# Altium project cat.PrjPcb (part 4 of 6)

## Sheet power.SchDoc: Power
size A3; SheetNumber: 4; SheetTotal: 6
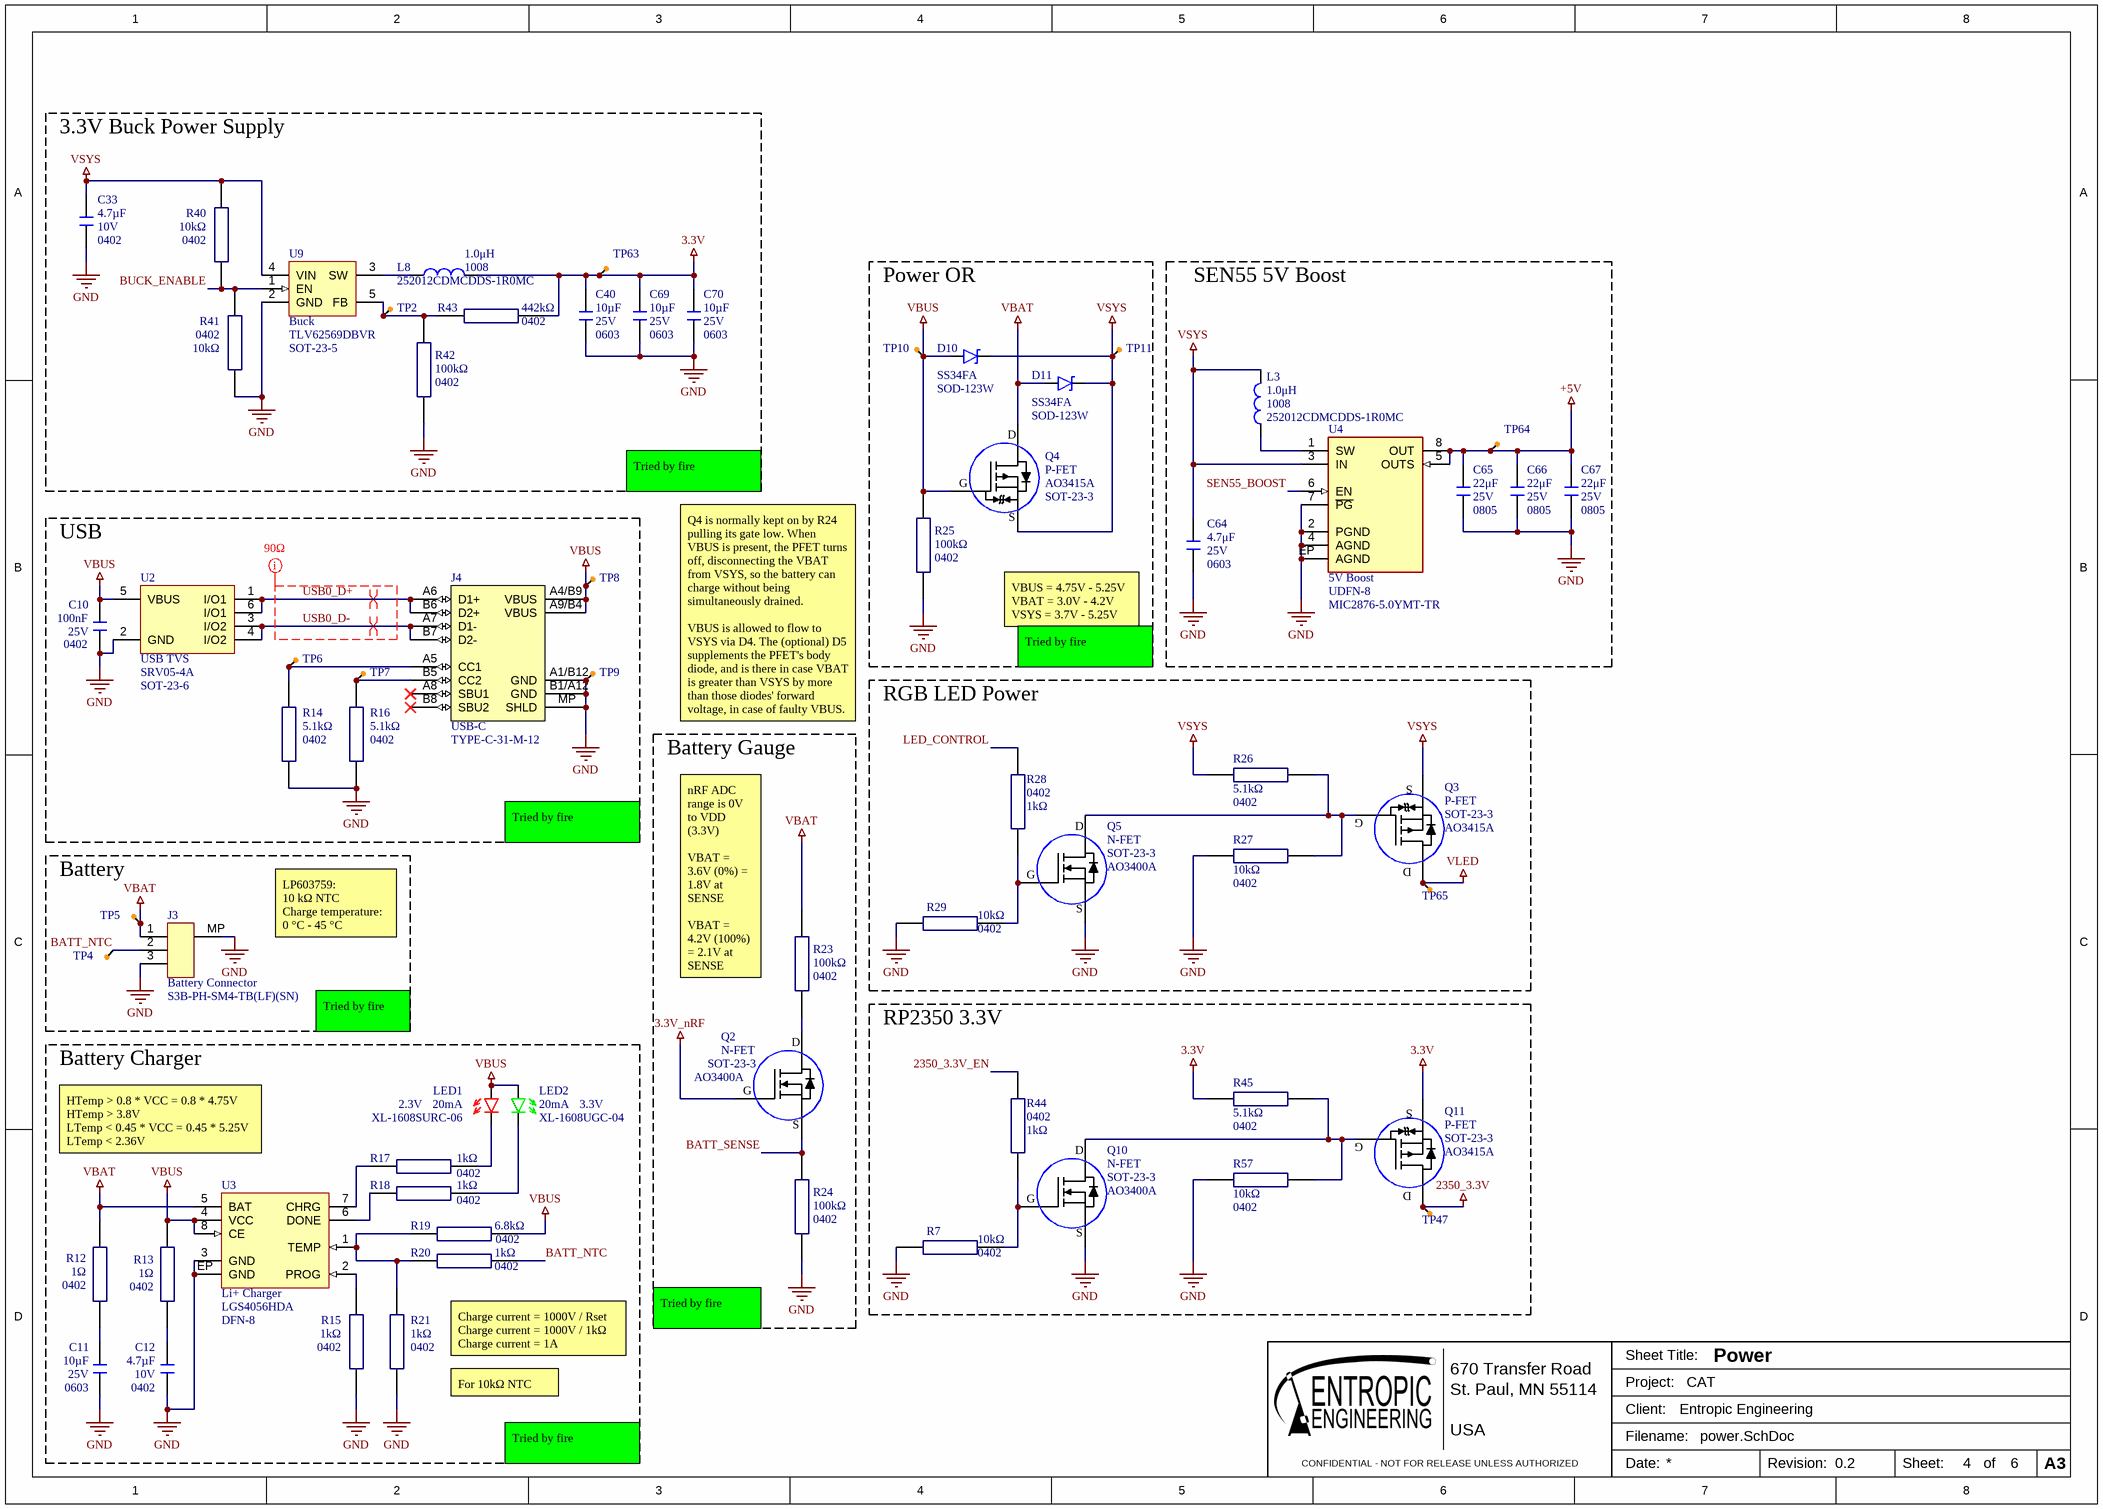
[diagram p3: power.SchDoc]

### Parts
C10  Case Code (Imperial): 0402  Voltage: 25V  Capacitance: 100nF  [0402_capacitor]  (hidden comment: GRM155R71E104KE14D)
C11  value 10µF  Case/Package: 0603  Voltage Rating: 25V  [0603_capacitor]  (hidden comment: CL10A106MA8NRNC)
C12  value 4.7µF  Voltage Rating: 10V  Case/Package: 0402  [0402_capacitor]  (hidden comment: CL05A475KP5NRNC)
C33  value 4.7µF  Voltage Rating: 10V  Case/Package: 0402  [0402_capacitor]  (hidden comment: CL05A475KP5NRNC)
C40  value 10µF  Case/Package: 0603  Voltage Rating: 25V  [0603_capacitor]  (hidden comment: CL10A106MA8NRNC)
C64  value 4.7μF  Case/Package: 0603  Voltage Rating: 25V  [0603_capacitor]  (hidden comment: C1608X5R1E475K080AC)
C65  value 22μF  Rated DC Voltage (URdc): 25V  Case/Package: 0805  [0805_capacitor]  (hidden comment: GRT21BR61E226ME13L)
C66  value 22μF  Rated DC Voltage (URdc): 25V  Case/Package: 0805  [0805_capacitor]  (hidden comment: GRT21BR61E226ME13L)
C67  value 22μF  Rated DC Voltage (URdc): 25V  Case/Package: 0805  [0805_capacitor]  (hidden comment: GRT21BR61E226ME13L)
C69  value 10µF  Case/Package: 0603  Voltage Rating: 25V  [0603_capacitor]  (hidden comment: CL10A106MA8NRNC)
C70  value 10µF  Case/Package: 0603  Voltage Rating: 25V  [0603_capacitor]  (hidden comment: CL10A106MA8NRNC)
D10  Case/Package: SOD-123W  [SOD-123]  (hidden comment: SS34FA)
D11  Case/Package: SOD-123W  [SOD-123]  (hidden comment: SS34FA)
J3  Battery Connector  [S3B-PH-SM4-TB]
J4  USB-C  Manufacturer Part Number: TYPE-C-31-M-12  [USB_C_2.0_M12]
L3  value 1.0μH  Package: 1008  [INDC2520X12N]  (hidden comment: 252012CDMCDDS-1R0MC)
L8  value 1.0μH  Package: 1008  [INDC2520X12N]  (hidden comment: 252012CDMCDDS-1R0MC)
LED1  Current: 20mA  Forward Voltage: 2.3V  [0603_DIODE]  (hidden comment: XL-1608SURC-06)
LED2  Current: 20mA  Forward Voltage: 3.3V  [0603_DIODE]  (hidden comment: XL-1608UGC-04)
Q2  N-FET  Case/Package: SOT-23-3  [SOT95P280X115-3N]
Q3  P-FET  Case/Package: SOT-23-3  [SOT95P280X115-3N]
Q4  P-FET  Case/Package: SOT-23-3  [SOT95P280X115-3N]
Q5  N-FET  Case/Package: SOT-23-3  [SOT95P280X115-3N]
Q10  N-FET  Case/Package: SOT-23-3  [SOT95P280X115-3N]
Q11  P-FET  Case/Package: SOT-23-3  [SOT95P280X115-3N]
R7  value 10kΩ  Case Code (Imperial): 0402  [0402_resistor]  (hidden comment: RC0402FR-0710KL)
R12  value 1Ω  Case/Package: 0402  [0402_resistor]  (hidden comment: 0402WGF100KTCE)
R13  value 1Ω  Case/Package: 0402  [0402_resistor]  (hidden comment: 0402WGF100KTCE)
R14  value 5.1kΩ  Case/Package: 0402  [0402_resistor]  (hidden comment: RC0402FR-075K1L)
R15  value 1kΩ  Case/Package: 0402  [0402_resistor]  (hidden comment: Rset)
R16  value 5.1kΩ  Case/Package: 0402  [0402_resistor]  (hidden comment: RC0402FR-075K1L)
R17  value 1kΩ  Case/Package: 0402  [0402_resistor]  (hidden comment: RC0402JR-071KL)
R18  value 1kΩ  Case/Package: 0402  [0402_resistor]  (hidden comment: RC0402JR-071KL)
R19  value 6.8kΩ  Case/Package: 0402  [0402_resistor]  (hidden comment: RC0402FR-076K8L)
R20  value 1kΩ  Case/Package: 0402  [0402_resistor]  (hidden comment: RC0402JR-071KL)
R21  value 1kΩ  Case/Package: 0402  [0402_resistor]  (hidden comment: Rset)
R23  value 100kΩ  Case/Package: 0402  [0402_resistor]  (hidden comment: RC0402FR-07100KL)
R24  value 100kΩ  Case/Package: 0402  [0402_resistor]  (hidden comment: RC0402FR-07100KL)
R25  value 100kΩ  Case/Package: 0402  [0402_resistor]  (hidden comment: RC0402FR-07100KL)
R26  value 5.1kΩ  Case/Package: 0402  [0402_resistor]  (hidden comment: RC0402FR-075K1L)
R27  value 10kΩ  Case Code (Imperial): 0402  [0402_resistor]  (hidden comment: RC0402FR-0710KL)
R28  value 1kΩ  Case/Package: 0402  [0402_resistor]  (hidden comment: RC0402JR-071KL)
R29  value 10kΩ  Case Code (Imperial): 0402  [0402_resistor]  (hidden comment: RC0402FR-0710KL)
R40  value 10kΩ  Case Code (Imperial): 0402  [0402_resistor]  (hidden comment: RC0402FR-0710KL)
R41  value 10kΩ  Case Code (Imperial): 0402  [0402_resistor]  (hidden comment: RC0402FR-0710KL)
R42  value 100kΩ  Case/Package: 0402  [0402_resistor]  (hidden comment: RC0402FR-07100KL)
R43  value 442kΩ  Case/Package: 0402  [0402_resistor]  (hidden comment: RC0402FR-07442KL)
R44  value 1kΩ  Case/Package: 0402  [0402_resistor]  (hidden comment: RC0402JR-071KL)
R45  value 5.1kΩ  Case/Package: 0402  [0402_resistor]  (hidden comment: RC0402FR-075K1L)
R57  value 10kΩ  Case Code (Imperial): 0402  [0402_resistor]  (hidden comment: RC0402FR-0710KL)
TP2  test_point-1  [test_point-1]  (value not drawn)  (no BOM)
TP4  test_point-1  [test_point-1]  (value not drawn)  (no BOM)
TP5  VBAT  [test_point-1]  (value not drawn)  (no BOM)
TP6  test_point-1  [test_point-1]  (value not drawn)  (no BOM)
TP7  test_point-1  [test_point-1]  (value not drawn)  (no BOM)
TP8  VBUS  [test_point-1]  (value not drawn)  (no BOM)
TP9  GND  [test_point-1]  (value not drawn)  (no BOM)
TP10  VBUS  [test_point-1]  (value not drawn)  (no BOM)
TP11  VSYS  [test_point-1]  (value not drawn)  (no BOM)
TP47  VLED  [test_point-1]  (value not drawn)  (no BOM)
TP63  Main 3.3V  [test_point-1]  (value not drawn)  (no BOM)
TP64  Sensors 5V  [test_point-1]  (value not drawn)  (no BOM)
TP65  VLED  [test_point-1]  (value not drawn)  (no BOM)
U2  USB TVS  Case/Package: SOT-23-6  [SOT95P280X110-6N]
U3  Li+ Charger  Manufacturer Part Number: LGS4056HDA  Package: DFN-8  [SON50P200X80_HS-9N]
U4  5V Boost  Case/Package: UDFN-8  [SON50P200X50_HS-9N]
U9  Buck  Case/Package: SOT-23-5  [SOT95P280X115-5N]

### Blocks framed on the sheet
3.3V Buck Power Supply: C33 C40 C69 C70 L8 R40-R43 TP2 TP63 U9
Power OR: D10 D11 Q4 R25 TP10 TP11
SEN55 5V Boost: C64-C67 L3 TP64 U4
USB: C10 J4 R14 R16 TP6-TP9 U2
RGB LED Power: Q3 Q5 R26-R29 TP65
Battery Gauge: Q2 R23 R24
Battery: J3 TP4 TP5
RP2350 3.3V: Q10 Q11 R7 R44 R45 R57 TP47
Battery Charger: C11 C12 LED1 LED2 R12 R13 R15 R17-R21 U3

### Nets
3.3V: C40.2 C69.2 C70.2 L8.2 Q11.2(S) R43.2 R45.2 TP63.1
3.3V_nRF: Q2.1(G)
2350_3.3V: Q11.3(D) TP47.1
+5V: C65.2 C66.2 C67.2 TP64.1 U4.5(OUTS) U4.8(OUT)
GND: C10.1 C11.1 C12.1 C33.1 C40.1 C64.1 C65.1 C66.1 C67.1 C69.1 C70.1 J3.3 J3.MP J4.A1/B12(GND) J4.B1/A12(GND) J4.MP(SHLD) Q5.2(S) Q10.2(S) R7.2 R14.1 R15.1 R16.1 R21.1 R24.1 R25.1 R27.2 R29.2 R41.1 R42.1 R57.2 TP9.1 U2.2(GND) U3.3(GND) U3.EP(GND) U4.2(PGND) U4.4(AGND) U4.7(~{PG}) U4.EP(AGND) U9.2(GND)
VBAT: D11.A J3.1 Q4.3(D) R12.2 R23.2 TP5.1 U3.5(BAT)
VBUS: C10.2 D10.A J4.A4/B9(VBUS) J4.A9/B4(VBUS) LED1.2 LED2.2 Q4.1(G) R13.2 R19.1 R25.2 TP8.1 TP10.1 U2.5(VBUS) U3.4(VCC) U3.8(CE)
VLED: Q3.3(D) TP65.1
VSYS: C33.2 C64.2 D10.K D11.K L3.1 Q3.2(S) Q4.2(S) R26.2 R40.2 TP11.1 U4.3(IN) U9.4(VIN)
2350_3.3V_EN: R44.1
BATT_NTC: J3.2 R20.1 TP4.1
BATT_SENSE: Q2.2(S) R24.2
BUCK_ENABLE: R40.1 R41.2 U9.1(EN)
LED_CONTROL: R28.1
SEN55_BOOST: U4.6(EN)
USB0_D+: J4.A6(D1+) J4.B6(D2+) U2.1(I/O1) U2.6(I/O1)
USB0_D-: J4.A7(D1-) J4.B7(D2-) U2.3(I/O2) U2.4(I/O2)
NetC11_2: C11.2 R12.1
NetC12_2: C12.2 R13.1
NetJ4_A5: J4.A5(CC1) R14.2 TP6.1
NetJ4_B5: J4.B5(CC2) R16.2 TP7.1
NetL3_2: L3.2 U4.1(SW)
NetL8_1: L8.1 U9.3(SW)
NetLED1_1: LED1.1 R17.1
NetLED2_1: LED2.1 R18.1
NetQ2_3: Q2.3(D) R23.1
NetQ3_1: Q3.1(G) Q5.3(D) R26.1 R27.1
NetQ5_1: Q5.1(G) R28.2 R29.1
NetQ10_1: Q10.1(G) R7.1 R44.2
NetQ10_3: Q10.3(D) Q11.1(G) R45.1 R57.1
NetR15_2: R15.2 U3.2(PROG)
NetR17_2: R17.2 U3.7(CHRG)
NetR18_2: R18.2 U3.6(DONE)
NetR19_2: R19.2 R20.2 R21.2 U3.1(TEMP)
NetR42_2: R42.2 R43.1 TP2.1 U9.5(FB)

Not connected (* = marked no-connect by the designer): J4 A8(SBU1)* B8(SBU2)*

### Layout directives
net class 90_OHM: USB0_D+, USB0_D-
differential pair; differential pair class USB_DIFF: USB0_D+, USB0_D-

### Notes on the sheet
- Tried by fire
- VBUS = 4.75V - 5.25V
  VBAT = 3.0V - 4.2V
  VSYS = 3.7V - 5.25V
- Q4 is normally kept on by R24 pulling its gate low. When VBUS is present, the PFET turns off, disconnecting the VBAT from VSYS, so the battery can charge without being simultaneously drained.
  VBUS is allowed to flow to VSYS via D4. The (optional) D5 supplements the PFET's body diode, and is there in case VBAT is greater than VSYS by more than those diodes' forward voltage, in case of faulty VBUS.
- LP603759:
  10 kΩ NTC
  Charge temperature:
  0 °C - 45 °C
- (near R23) nRF ADC range is 0V to VDD (3.3V)
  VBAT = 3.6V (0%) = 1.8V at SENSE
  VBAT = 4.2V (100%) = 2.1V at SENSE
- HTemp > 0.8 * VCC = 0.8 * 4.75V
  HTemp > 3.8V
  LTemp < 0.45 * VCC = 0.45 * 5.25V
  LTemp < 2.36V
- For 10kΩ NTC
- Charge current = 1000V / Rset
  Charge current = 1000V / 1kΩ
  Charge current = 1A
- 670 Transfer Road
- St. Paul, MN 55114
- Sheet Title:
- Project:
- CONFIDENTIAL - NOT FOR RELEASE UNLESS AUTHORIZED
- USA
- Client:
- Filename:
- Date:
- Revision:
- Sheet:
- of
- A3

### Library data of the parts
C10 = GRM155R71E104KE14D: 100 nF, 25 V, X7R, 0402 Chip capacitor; Manufacturer: Murata; house_part_number: C-100nF-0402-002; Dielectric Material: Ceramic; Tolerance: 10%; Supplier 1: Digi-Key; Supplier Part Number 1: 490-10698-1-ND; RoHS: Yes; Category: Ceramic Capacitors; Pricing 1: 1=0.10000, 10=0.02700, 50=0.01460, 100=0.01190, 500=0.00848, 1000=0.00666, 2500=0.00605, 5000=0.00557 (USD); Mount: Surface Mount; Case/Package: 0402; Case Code (Metric): 1005; Weight: 0.000212oz; Min Operating Temperature: -55°C; Max Operating Temperature: 125°C; Packaging: Tape and Reel; Voltage Rating: 25V; Dielectric: X7R; Termination: SMD/SMT; Resistor Type: Ceramic; Voltage Rating (DC): 25V; Package Quantity: 10000; Length: 1mm; Width: 0.02inch; Height: 0.5mm; Thickness: 0.022inch; Depth: 0.5mm; REACH SVHC: Unknown; Lead Free: Lead Free; RoHS Compliant: Yes; ComponentLink1URL: http://www.farnell.com/datasheets/1872206.pdf?src-supplier=Farnell; ComponentLink1Description: http://www.farnell.com/datasheets/1872206.pdf?src-supplier=Farnell; ComponentLink2URL: http://components.arrow.com/part/dataview/0323_06361249?src-supplier=Arrow+Europe; ComponentLink2Description: http://components.arrow.com/part/dataview/0323_06361249?src-supplier=Arrow+Europe; ComponentLink3URL: http://uk.rs-online.com/webdocs/144c/0900766b8144c113.pdf?src-supplier=RSComponents; ComponentLink3Description: http://uk.rs-online.com/webdocs/144c/0900766b8144c113.pdf?src-supplier=RSComponents; ComponentLink4URL: http://www.farnell.com/datasheets/2048008.pdf?src-supplier=Farnell; ComponentLink4Description: http://www.farnell.com/datasheets/2048008.pdf?src-supplier=Farnell; ComponentLink5URL: http://www.mouser.com/ds/2/281/c02e-2905.pdf?src-supplier=Mouser; ComponentLink5Description: http://www.mouser.com/ds/2/281/c02e-2905.pdf?src-supplier=Mouser; ComponentLink6URL: http://www.farnell.com/datasheets/2048008.pdf?src-supplier=Newark; ComponentLink6Description: http://www.farnell.com/datasheets/2048008.pdf?src-supplier=Newark; ComponentLink7URL: https://search.murata.co.jp/Ceramy/image/img/A01X/G101/ENG/GRM155R71E104KE14-01.pdf?src-supplier=Digi-Key; ComponentLink7Description: https://search.murata.co.jp/Ceramy/image/img/A01X/G101/ENG/GRM155R71E104KE14-01.pdf?src-supplier=Digi-Key; ComponentLink8URL: http://www.farnell.com/datasheets/2048008.pdf?src-supplier=Element14; ComponentLink8Description: http://www.farnell.com/datasheets/2048008.pdf?src-supplier=Element14; ComponentLink9URL: http://psearch.en.murata.com/capacitor/product/GRM155R71E104KE14%23.pdf?src-supplier=Avnet; ComponentLink9Description: http://psearch.en.murata.com/capacitor/product/GRM155R71E104KE14%23.pdf?src-supplier=Avnet; Manufacturer Part Number: GRM155R71E104KE14D
C11 C40 C69 C70 = CL10A106MA8NRNC: 10 µF, 25 V, X5R, 0603 Chip capacitor; Manufacturer: Samsung; house_part_number: C-10uF-0603-002; Tolerance: 20%; Material: 4241ConductorMaterial; RoHS: Yes; Category: Ceramic Capacitors; Case Code (Metric): 1608; Min Operating Temperature: -55°C; Max Operating Temperature: 85°C; Packaging: Cut Tape; RoHS Compliant: Yes; ComponentLink1URL: https://datasheet.ciiva.com/25766/cl10a106ma8nrnc-25766562.pdf?src-supplier=Digikey; ComponentLink1Description: https://datasheet.ciiva.com/25766/cl10a106ma8nrnc-25766562.pdf?src-supplier=Digikey; Manufacturer Part Number: CL10A106MA8NRNC; Case Code (Imperial): 0603; Stock: 632000; Pricing: 4000=0.0511, 8000=0.046, 12000=0.0434, 28000=0.0413, 100000=0.0356 (USD); Mounting Technology: Surface Mount; Series: CL; Height: 900um; Lead Free: Lead Free; Supplier Part Number 1: CL10A106MA8NRNC; Supplier 1: Arrow Electronics
C12 C33 = CL05A475KP5NRNC: 4.7 µF, 10 V, X5R, 0402 Chip capacitor; Manufacturer: Samsung; house_part_number: C-4.7uF-0402-002; Material: Ceramic; Tolerance: 10%; RoHS: Yes; Category: Ceramic Capacitors; Min Operating Temperature: -55°C; Max Operating Temperature: 85°C; Packaging: Tape and Reel; RoHS Compliant: Yes; ComponentLink1URL: https://datasheet.ciiva.com/25724/cl05a475kp5nrnc-25724404.pdf?src-supplier=Digikey; ComponentLink1Description: https://datasheet.ciiva.com/25724/cl05a475kp5nrnc-25724404.pdf?src-supplier=Digikey; ComponentLink2URL: https://datasheet.ciiva.com/29198/458873-da-01-en-vs-kondensator-0402-29198304.pdf?src-supplier=Conrad; ComponentLink2Description: https://datasheet.ciiva.com/29198/458873-da-01-en-vs-kondensator-0402-29198304.pdf?src-supplier=Conrad; Manufacturer Part Number: CL05A475KP5NRNC; Stock: 606274; Pricing: 1=0.28, 10=0.184, 50=0.129, 100=0.1042, 500=0.0774, 1000=0.06772, 2500=0.0645, 5000=0.05966 (USD); Mounting Technology: Surface Mount; Case Code (Metric): 1005; Case Code (Imperial): 0402; Package Quantity: 1; Dielectric: X5R; Series: CL; Construction: Flat; Length: 1mm; Width: 0.02inch; Height: 0.5mm; Thickness: 0.022inch; Depth: 0.5mm; Radiation Hardening: No; Lead Free: Lead Free; Supplier Part Number 1: 1276-1480-1-ND; Supplier 1: Digikey
C64 = C1608X5R1E475K080AC: 4.7 μF, 25 V, X7R, 0603 Chip capacitor; Manufacturer: TDK; Dielectric Material: Ceramic; Tolerance: 10%; Dielectric: X5R; Supplier: Digikey; Supplier Part Number: 445-9050-1-ND; Manufacturer Part Number: C1608X5R1E475K080AC; RoHS: Yes; Category: Ceramic Capacitors; Stock: 1983872; Pricing: 1=0.16, 10=0.104, 50=0.0732, 100=0.0592, 500=0.04396, 1000=0.03847, 4000=0.03389, 8000=0.03225 (USD); Mounting Technology: Surface Mount; Case Code (Metric): 1608; Case Code (Imperial): 0603; Weight: 7.1E-05oz; Material: Ceramic; Min Operating Temperature: -55°C; Max Operating Temperature: 85°C; Packaging: Tape and Reel; Package Quantity: 4000; Voltage Rating (DC): 25V; Termination: SMD/SMT; Series: C; Construction: Flat; Length: 1.6mm; Width: 0.031inch; Height: 0.8mm; Thickness: 0.039inch; Depth: 0.8mm; Lead Free: Lead Free; RoHS Compliant: Yes; Reach SVHC Compliant: Unknown; ComponentLink1URL: https://datasheet.ciiva.com/48671/mlcc-commercial-general-en-48671304.pdf?src-supplier=Avnet; ComponentLink1Description: https://datasheet.ciiva.com/48671/mlcc-commercial-general-en-48671304.pdf?src-supplier=Avnet; ComponentLink2URL: https://datasheet.ciiva.com/24216/mlcc-commercial-general-en-24216326.pdf?src-supplier=Mouser; ComponentLink2Description: https://datasheet.ciiva.com/24216/mlcc-commercial-general-en-24216326.pdf?src-supplier=Mouser; ComponentLink3URL: https://datasheet.ciiva.com/48587/6print-detail-pdf-phplangenpart-noc1608x5r1e475k080acimp-unit-xmhz-48587141.pdf?src-supplier=Onlinecomponents.com; ComponentLink3Description: https://datasheet.ciiva.com/48587/6print-detail-pdf-phplangenpart-noc1608x5r1e475k080acimp-unit-xmhz-48587141.pdf?src-supplier=Onlinecomponents.com
C65-C67 = GRT21BR61E226ME13L: 22 μF, 25 V, X5R, 0805 Chip capacitor; Manufacturer: Murata; Dielectric Material: Ceramic; Multilayer: Yes; Tolerance  (fill in as +-): 20%; Reference Standard: AEC-Q200; Supplier 1: Digi-Key; RoHS: Yes; Category: Ceramic Capacitors; Stock 1: 1983731; Pricing 1: 1=0.48, 10=0.338, 50=0.2558, 100=0.2228, 500=0.16508, 1000=0.14031 (USD); Mounting Technology: Surface Mount; Pins: 2; Package Shape: Rectangular; Terminal Finish: Nickel; Min Operating Temperature: -55°C; Max Operating Temperature: 85°C; JESD-609 Code: e3; Capacitor Type: Ceramic; Packaging: Tape and Reel; Tolerance (fill in as +-): 20%; Temperature Characteristics Code: X5R; Termination: Wraparound; Reach SVHC Compliant: Yes; RoHS Compliant: Yes; ComponentLink1URL: https://datasheet.ciiva.com:443/pdfs/VipMasterIC/IC/MURE/MURE-S-A0004410517/MURE-S-A0004413512-1.pdf?src-supplier=IHS+Markit; ComponentLink1Description: https://datasheet.ciiva.com:443/pdfs/VipMasterIC/IC/MURE/MURE-S-A0004410517/MURE-S-A0004413512-1.pdf?src-supplier=IHS+Markit; ComponentLink2URL: http://search.murata.co.jp/Ceramy/image/img/A01X/G101/ENG/GRT21BR61E226ME13-01.pdf?src-supplier=Digi-Key; ComponentLink2Description: http://search.murata.co.jp/Ceramy/image/img/A01X/G101/ENG/GRT21BR61E226ME13-01.pdf?src-supplier=Digi-Key; Manufacturer Part Number: GRT21BR61E226ME13L; Supplier Part Number 1: 490-12389-1-ND
D10 D11 = SS34FA: 40 V, 3 A Schottky Rectifier, SOD-123FA; Manufacturer: ON Semiconductor / Fairchild; house_part_number: D-SCHOTTKY-3A-SOD123F-002; Max Forward Surge Current (Ifsm): 80A; Max Repetitive Reverse Voltage (Vrrm): 40V; Average Rectified Current: 3A; Element Configuration: Single; RoHS: Yes; Category: Schottky Diodes; RoHS Compliant: Yes; ComponentLink1URL: http://www.farnell.com/datasheets/2552647.pdf?src-supplier=Farnell; ComponentLink1Description: http://www.farnell.com/datasheets/2552647.pdf?src-supplier=Farnell; ComponentLink2URL: http://www.mouser.com/ds/2/149/SS34FA-1012641.pdf?src-supplier=Mouser; ComponentLink2Description: http://www.mouser.com/ds/2/149/SS34FA-1012641.pdf?src-supplier=Mouser; ComponentLink3URL: http://www.farnell.com/datasheets/2552647.pdf?src-supplier=Element14; ComponentLink3Description: http://www.farnell.com/datasheets/2552647.pdf?src-supplier=Element14; ComponentLink4URL: http://www.farnell.com/datasheets/2552647.pdf?src-supplier=Newark; ComponentLink4Description: http://www.farnell.com/datasheets/2552647.pdf?src-supplier=Newark; ComponentLink5URL: https://www.fairchildsemi.com/datasheets/SS/SS34FA.pdf?src-supplier=Digikey; ComponentLink5Description: https://www.fairchildsemi.com/datasheets/SS/SS34FA.pdf?src-supplier=Digikey; ComponentLink6URL: https://www.onsemi.com/pub/Collateral/SS36FA-D.PDF?src-supplier=Digikey; ComponentLink6Description: https://www.onsemi.com/pub/Collateral/SS36FA-D.PDF?src-supplier=Digikey; ComponentLink7URL: https://datasheet.octopart.com/SS34FA-ON-Semiconductor-datasheet-137713515.pdf?src-supplier=TME; ComponentLink7Description: https://datasheet.octopart.com/SS34FA-ON-Semiconductor-datasheet-137713515.pdf?src-supplier=TME; Manufacturer Part Number: SS34FA; Supplier 1: LCSC; Supplier Part Number 1: C719833; Supplier: Avnet; Supplier Part Number: 01AC9736; Stock: 2402; Pricing: 1=0.469, 25=0.4, 50=0.341, 100=0.281, 250=0.251 (USD); Mounting Technology: Surface Mount; Weight: 0.019g; Packaging: Cut Tape; Max Reverse Voltage (DC): 40V; Series: Automotive, AEC-Q101
J3 = S3B-PH-SM4-TB(LF)(SN): 3-Pin JST-PH connector, 2mm pitch, right-angle SMD; Manufacturer: JST; Current Rating: 2A; Voltage Rating: 100V; Contact Resistance: 10mR; Number of Poles: 3; Insulation Resistance: 1GR; Gender: Male; Connector Type: Header; Supplier 1: LCSC; RoHS: Yes; Category: Headers and Wire Housings; Stock 1: 30540; Pricing 1: 5=0.223, 50=0.1765, 150=0.1538, 1000=0.1202, 2000=0.1152, 5000=0.1122 (USD); Mounting Technology: Surface Mount; Contact Material: Copper Alloy,Tin,Bronze,Brass; Contact Plating: Tin,Copper; Color: Natural,White; Housing Color: Beige; Housing Material: Polyamide; Material: Polyamide; Contact Shape: Square; Insulation Material: Nylon; Insulation Color: Natural; Contact Finish - Mating: TIN; Weight: 28.349523g; Min Operating Temperature: -25°C; Max Operating Temperature: 85°C; Number of Rows: 1; Voltage Rating (AC): 100V; Max Current Rating: 2A; Packaging: Tape and Reel; Number of Positions: 3; Termination: Solder; Fastening Type: Detent; Number of Contacts: 3; Working Voltage: 100V; Max Voltage Rating (AC): 100V; Max Voltage Rating (DC): 100V; Orientation: Right Angle; Contact Type: Male Pin; Voltage Rating (DC): 100V; Length: 9.9mm; Width: 5mm; Height: 9.4mm; Lead Pitch: 2mm; Pitch: 2mm; Contact Mating Length: 0.13inch; Depth: 7.6mm; Reach SVHC Compliant: No; Flammability Rating: UL94 V-0; Lead Free: 5697LeadFree; ComponentLink1URL: https://datasheet.ciiva.com/11748/0900766b80df0d9d-11748720.pdf?src-supplier=Rs; ComponentLink1Description: https://datasheet.ciiva.com/11748/0900766b80df0d9d-11748720.pdf?src-supplier=Rs; ComponentLink2URL: https://datasheet.ciiva.com/712/eph-712555.pdf?src-supplier=Digikey; ComponentLink2Description: https://datasheet.ciiva.com/712/eph-712555.pdf?src-supplier=Digikey; ComponentLink3URL: https://datasheet.ciiva.com/712/eph-712554.pdf?src-supplier=Digikey; ComponentLink3Description: https://datasheet.ciiva.com/712/eph-712554.pdf?src-supplier=Digikey; ComponentLink4URL: https://datasheet.ciiva.com/712/eph-712556.pdf?src-supplier=Digikey; ComponentLink4Description: https://datasheet.ciiva.com/712/eph-712556.pdf?src-supplier=Digikey; ComponentLink5URL: https://datasheet.ciiva.com/8052/80594-8052219.pdf?src-supplier=Element14; ComponentLink5Description: https://datasheet.ciiva.com/8052/80594-8052219.pdf?src-supplier=Element14; ComponentLink6URL: https://datasheet.ciiva.com/22693/80594-22693485.pdf?src-supplier=Element14; ComponentLink6Description: https://datasheet.ciiva.com/22693/80594-22693485.pdf?src-supplier=Element14; Supplier Part Number 1: C265101; Series: PH; Manufacturer Part Number: S3B-PH-SM4-TB(LF)(SN); house_part_number: S3B-PH-SM4-TB(LF)(SN)
J4 = USB4105-GF-A: USB-C 2.0 Female Connector; Manufacturer: Global Connector Technology; Alternate Manufacturer: Korean HROparts Elec; Connector Type: USB; Gender: Receptacle; Mating Cycles: 10000; Shielding: Shielded; Number of Ports: 1; RoHS: No; Category: USB Connectors; Stock: 1499; Pricing: 1=1, 20=3.07, 60=3.02, 160=2.64, 400=2.63 (EUR); Mounting Technology: Surface Mount,Through Hole,Horizontal; Contact Plating: Gold; Insulation Color: Black; Min Operating Temperature: -40°C; Max Operating Temperature: 85°C; Series: USB4105; Termination: Solder; Flammability Rating: UL94 V-0; ComponentLink1URL: https://gct.co/files/drawings/usb4105.pdf?src-supplier=Digi-Key; ComponentLink1Description: https://gct.co/files/drawings/usb4105.pdf?src-supplier=Digi-Key; Alternate Part Number: USB4105-GF-A; house_part_number: USB_C_2.0_M12; Supplier 1: Farnell; Supplier Part Number 1: 3588205
L3 L8 = 252012CDMCDDS-1R0MC: 1 μH, 4.2 A, 1008 Inductor; Manufacturer: Sumida; house_part_number: L-1uH-1008-002; Supplier: Digikey; Supplier Part Number 1: 308-2603-1-ND; RoHS: No; Category: Fixed Inductors; Stock: 45912; Pricing: 1=0.55, 10=0.473, 25=0.434, 50=0.3944, 100=0.3511, 250=0.33132, 500=0.284, 1000=0.25245 (USD); Manufacturer Part Number: 252012CDMCDDS-1R0MC
LED1 = XL-1608SURC-06: Red LED, 1.9 - 2.3 V, 20 mA, 0603; Manufacturer: XINGLIGHT; Supplier 1: LCSC; RoHS: No; Stock 1: 3172200; Pricing 1: 100=0.0029, 1000=0.0022, 4000=0.0019, 8000=0.0017, 48000=0.0015 (USD); Supplier Part Number 1: C965799; Manufacturer Part Number: XL-1608SURC-06; house_part_number: XL-1608SURC-06
LED2 = XL-1608UGC-04: Green LED, 2.7 - 3.3 V, 20 mA, 0603; Manufacturer: XINGLIGHT; Supplier 1: LCSC; RoHS: No; Stock 1: 2830700; Pricing 1: 100=0.0042, 1000=0.0033, 4000=0.0027, 8000=0.0024, 48000=0.0023, 100000=0.0022 (USD); Supplier Part Number 1: C965804; Manufacturer Part Number: XL-1608UGC-04; house_part_number: XL-1608UGC-04
Q2 Q5 Q10 = AO3400A: N-FET, 30V, 5.7A, SOT-23-3; Manufacturer: Alpha & Omega Semiconductor; Rds On Max: 26.5mR; Input Capacitance: 630pF; Max Power Dissipation: 1.4W; Drain to Source Resistance: 18mR; Number of Channels: 1NUMBER; Threshold Voltage: 650mV; Turn-Off Delay Time: 25ns; Turn-On Delay Time: 3ns; Supplier: Arrow Electronics; RoHS: Yes; Category: MOSFETs; Stock: 141000; Pricing: 3000=0.0899, 6000=0.0869, 9000=0.0763, 30000=0.0746, 75000=0.0627 (USD); Mounting Technology: Surface Mount; Min Operating Temperature: -55°C; Max Operating Temperature: 150°C; Packaging: Cut Tape; Drain to Source Voltage (Vdss): 30V; Continuous Drain Current (ID): 5.7A; Series: -; Drain to Source Breakdown Voltage: 30V; Height: 1.25mm; Lead Free: Lead Free; RoHS Compliant: Yes; ComponentLink1URL: https://datasheet.ciiva.com/940/ao3400a-940739.pdf?src-supplier=Digikey; ComponentLink1Description: https://datasheet.ciiva.com/940/ao3400a-940739.pdf?src-supplier=Digikey; ComponentLink2URL: https://datasheet.ciiva.com/26906/getdatasheetpartid-64438-26906526.pdf?src-supplier=Verical; ComponentLink2Description: https://datasheet.ciiva.com/26906/getdatasheetpartid-64438-26906526.pdf?src-supplier=Verical; ComponentLink3URL: https://datasheet.ciiva.com/940/ao3400a-940740.pdf?src-supplier=Digikey; ComponentLink3Description: https://datasheet.ciiva.com/940/ao3400a-940740.pdf?src-supplier=Digikey; ComponentLink4URL: https://datasheet.ciiva.com/940/ao3400a-940741.pdf?src-supplier=Digikey; ComponentLink4Description: https://datasheet.ciiva.com/940/ao3400a-940741.pdf?src-supplier=Digikey; Manufacturer Part Number: AO3400A; house_part_number: AO3400A; Supplier Part Number 1: AO3400A
Q3 Q4 Q11 = AO3415A: P-FET, 30V, 6A, SOT-23-3; Manufacturer: Alpha & Omega Semiconductor; Rds On Max: 45mΩ; Input Capacitance: 940pF; Drain to Source Voltage (Vdss): 20V; Continuous Drain Current (ID): 5A; Max Power Dissipation: 1.5W; Threshold Voltage: 8mV; Turn-Off Delay Time: 19ps; Turn-On Delay Time: 13ps; Supplier: Arrow Electronics; Supplier Part Number: AO3415A; RoHS: Yes; Category: MOSFETs; Stock: 21000; Pricing: 3000=0.3033, 6000=0.3003, 9000=0.2972, 15000=0.2942, 24000=0.2912, 30000=0.2881 (USD); Mounting Technology: Surface Mount; Pins: 3; Min Operating Temperature: -55°C; Max Operating Temperature: 150°C; Series: -; Packaging: Cut Tape; RoHS Compliant: Yes; ComponentLink1URL: https://datasheet.ciiva.com/940/ao3415-940752.pdf?src-supplier=Digikey; ComponentLink1Description: https://datasheet.ciiva.com/940/ao3415-940752.pdf?src-supplier=Digikey; ComponentLink2URL: https://datasheet.ciiva.com/940/ao3415-940753.pdf?src-supplier=Digikey; ComponentLink2Description: https://datasheet.ciiva.com/940/ao3415-940753.pdf?src-supplier=Digikey; Manufacturer Part Number: AO3415A; Supplier 1: LCSC; Supplier Part Number 1: C133233; house_part_number: AO3415A
R7 R27 R29 R40 R41 R57 = RC0402FR-0710KL: 10 kΩ, 0402 Chip resistor; Manufacturer: Yageo; house_part_number: R-10k-0402-1%-001; Tolerance: 1%; Power Rating: 62.5mW; Temperature Coefficient: 100ppm/°C; Max Power Dissipation: 63mW; Voltage Rating (DC): 50V; Manufacturer Part Number: RC0402FR-0710KL; RoHS: Yes; Category: Chip SMD Resistors; Case/Package: 0402; Case Code (Metric): 1005; Min Operating Temperature: -55°C; Max Operating Temperature: 155°C; Packaging: Tape and Reel; Resistor Type: Thick Film; Number of Terminations: 2; Features: Moisture Resistant; Series: RC; Construction: Rectangular; Length: 1mm; Width: 0.5mm; Depth: 0.5mm; Military Standard: Not; Lead Free: 5697LeadFree; RoHS Compliant: Yes; ComponentLink1URL: https://datasheet.ciiva.com/12667/pyu-rc0402-51-rohs-l-6-r-12667067.pdf?src-supplier=Mouser; ComponentLink1Description: https://datasheet.ciiva.com/12667/pyu-rc0402-51-rohs-l-6-r-12667067.pdf?src-supplier=Mouser; Stock: 9380606; Pricing: 1=0.1, 10=0.015, 50=0.0088, 100=0.0073, 500=0.00488, 1000=0.00417, 5000=0.00297 (USD); Pins: 2; Termination: SMD/SMT; Voltage Rating: 50V; Resistance Tolerance: 1%; Lead Pitch: 0.2mm; Reach SVHC Compliant: Unknown; Supplier 1: Digikey; Supplier Part Number 1: 311-10.0KLRCT-ND
R12 R13 = 0402WGF100KTCE: 1 Ω, 0402 Chip resistor; Manufacturer: Uniroyal; house_part_number: R-1-0402-1%-001; Supplier: LCSC; Manufacturer Part Number: 0402WGF100KTCE; RoHS: No; Stock: 596300; Pricing: 100=0.0008, 1000=0.0006, 3000=0.0005, 50000=0.0004 (USD); Supplier Part Number 1: C25086
R14 R16 R26 R45 = RC0402FR-075K1L: 5.1 kΩ, 0402 Chip resistor; Manufacturer: Yageo; house_part_number: R-5.1k-0402-1%-001; Power Rating: 63mW; Tolerance: 1%; Temperature Coefficient: 100ppm/°C; Voltage Rating: 50V; Manufacturer Part Number: RC0402FR-075K1L; RoHS: Yes; Category: Chip SMD Resistors; Stock: 1190000; Pricing: 10000=0.0024, 50000=0.0023, 250000=0.0021, 500000=0.0021, 1500000=0.0019 (USD); Case Code (Metric): 1005; Case Code (Imperial): 0402; Min Operating Temperature: -55°C; Max Operating Temperature: 155°C; Technology: THICK FILM; Packaging: Tape and Reel; Package Quantity: 1; Resistor Type: Thick Film; Number of Terminations: 2; Termination: SMD/SMT; Max Power Dissipation: 63mW; Working Voltage: 50V; Features: Moisture Resistant; Series: RC; Resistance Tolerance: 1%; Construction: Rectangular; Voltage Rating (DC): 50V; Length: 1mm; Width: 0.02inch; Height: 0.016inch; Depth: 0.5mm; RoHS Compliant: Yes; Military Standard: Not; Reach SVHC Compliant: Unknown; Lead Free: 5697LeadFree; ComponentLink1URL: https://datasheet.ciiva.com/7983/1018594-7983519.pdf?src-supplier=Element14; ComponentLink1Description: https://datasheet.ciiva.com/7983/1018594-7983519.pdf?src-supplier=Element14; ComponentLink2URL: https://datasheet.ciiva.com/46394/1018594-46394936.pdf?src-supplier=Element14; ComponentLink2Description: https://datasheet.ciiva.com/46394/1018594-46394936.pdf?src-supplier=Element14; ComponentLink3URL: https://datasheet.ciiva.com/2453/pyu-r-int-thick-7-2453401.pdf?src-supplier=Digikey; ComponentLink3Description: https://datasheet.ciiva.com/2453/pyu-r-int-thick-7-2453401.pdf?src-supplier=Digikey; ComponentLink4URL: https://datasheet.ciiva.com/2453/pyu-r-int-thick-7-2453402.pdf?src-supplier=Digikey; ComponentLink4Description: https://datasheet.ciiva.com/2453/pyu-r-int-thick-7-2453402.pdf?src-supplier=Digikey; ComponentLink5URL: https://datasheet.ciiva.com/2453/pyu-r-int-thick-7-2453400.pdf?src-supplier=Digikey; ComponentLink5Description: https://datasheet.ciiva.com/2453/pyu-r-int-thick-7-2453400.pdf?src-supplier=Digikey; ComponentLink6URL: https://datasheet.ciiva.com/12558/pyu-rc0402-51-rohs-l-6-r-8721-12558460.pdf?src-supplier=Mouser; ComponentLink6Description: https://datasheet.ciiva.com/12558/pyu-rc0402-51-rohs-l-6-r-8721-12558460.pdf?src-supplier=Mouser; ComponentLink7URL: https://datasheet.ciiva.com/16744/pyu-rc0402-51-rohs-l-6-r-16744283.pdf?src-supplier=Future+Electronics; ComponentLink7Description: https://datasheet.ciiva.com/16744/pyu-rc0402-51-rohs-l-6-r-16744283.pdf?src-supplier=Future+Electronics; ComponentLink8URL: https://datasheet.ciiva.com/15189/getdatasheetpartid-323636-15189493.pdf?src-supplier=Verical; ComponentLink8Description: https://datasheet.ciiva.com/15189/getdatasheetpartid-323636-15189493.pdf?src-supplier=Verical; Supplier 1: Future Electronics; Supplier Part Number 1: 6053649
R15 R21 R28 R44 = RC0402JR-071KL: 1 kΩ, 0402 Chip resistor; Manufacturer: Yageo; house_part_number: R-1k-0402-1%-001; Tolerance: 5%; Temperature Coefficient: 100ppm/°C; Voltage Rating: 50V; Power Rating: 62.5mW; Max Power Dissipation: 63mW; Manufacturer Part Number: RC0402JR-071KL; RoHS: Yes; Category: Chip SMD Resistors; Min Operating Temperature: -55°C; Max Operating Temperature: 155°C; Resistor Type: Thick Film; Packaging: Cut Tape; Termination: SMD/SMT; RoHS Compliant: Yes; ComponentLink1URL: https://datasheet.ciiva.com/7983/1018594-7983558.pdf?src-supplier=Element14; ComponentLink1Description: https://datasheet.ciiva.com/7983/1018594-7983558.pdf?src-supplier=Element14; ComponentLink2URL: https://datasheet.ciiva.com/2452/pyu-r-int-thick-7-2452756.pdf?src-supplier=Digikey; ComponentLink2Description: https://datasheet.ciiva.com/2452/pyu-r-int-thick-7-2452756.pdf?src-supplier=Digikey; ComponentLink3URL: https://datasheet.ciiva.com/2452/pyu-r-int-thick-7-2452757.pdf?src-supplier=Digikey; ComponentLink3Description: https://datasheet.ciiva.com/2452/pyu-r-int-thick-7-2452757.pdf?src-supplier=Digikey; ComponentLink4URL: https://datasheet.ciiva.com/2452/pyu-r-int-thick-7-2452755.pdf?src-supplier=Digikey; ComponentLink4Description: https://datasheet.ciiva.com/2452/pyu-r-int-thick-7-2452755.pdf?src-supplier=Digikey; ComponentLink5URL: https://datasheet.ciiva.com/7850/1018594-7850170.pdf?src-supplier=Element14; ComponentLink5Description: https://datasheet.ciiva.com/7850/1018594-7850170.pdf?src-supplier=Element14; Stock: 15490862; Pricing: 1=0.1, 10=0.018, 50=0.0102, 100=0.0083, 500=0.00528, 1000=0.00444, 5000=0.00307 (USD); Case Code (Imperial): 0402; Case Code (Metric): 1005; Series: RC; Voltage Rating (AC): 50V; Package Quantity: 1; Number of Terminations: 2; Features: Moisture Resistant; Resistance Tolerance: 5%; Length: 0.039inch; Width: 0.02inch; Height: 0.016inch; Reach SVHC Compliant: No; Lead Free: 5697LeadFree; ComponentLink6URL: https://datasheet.ciiva.com/7850/1018594-7850171.pdf?src-supplier=Element14; ComponentLink6Description: https://datasheet.ciiva.com/7850/1018594-7850171.pdf?src-supplier=Element14; ComponentLink7URL: https://datasheet.ciiva.com/17081/pyu-rc0402-51-rohs-l-6-r-17081438.pdf?src-supplier=Future+Electronics; ComponentLink7Description: https://datasheet.ciiva.com/17081/pyu-rc0402-51-rohs-l-6-r-17081438.pdf?src-supplier=Future+Electronics; Supplier 1: Digikey; Supplier Part Number 1: 311-1.0KJRCT-ND
R17 R18 = RC0402JR-071KL: 1 kΩ, 0402 Chip resistor; Manufacturer: Yageo; house_part_number: R-1k-0402-1%-001; Power Rating: 62.5mW; Tolerance: 5%; Voltage Rating: 50V; Temperature Coefficient: 100ppm/°C; Max Power Dissipation: 63mW; Manufacturer Part Number: RC0402JR-071KL; RoHS: Yes; Category: Chip SMD Resistors; Stock: 15490862; Pricing: 1=0.1, 10=0.018, 50=0.0102, 100=0.0083, 500=0.00528, 1000=0.00444, 5000=0.00307 (USD); Case Code (Imperial): 0402; Case Code (Metric): 1005; Min Operating Temperature: -55°C; Max Operating Temperature: 155°C; Series: RC; Packaging: Cut Tape; Package Quantity: 1; Termination: SMD/SMT; Resistor Type: Thick Film; Number of Terminations: 2; Features: Moisture Resistant; Resistance Tolerance: 5%; Voltage Rating (AC): 50V; Length: 0.039inch; Width: 0.02inch; Height: 0.016inch; Reach SVHC Compliant: No; RoHS Compliant: Yes; Lead Free: 5697LeadFree; ComponentLink1URL: https://datasheet.ciiva.com/7983/1018594-7983558.pdf?src-supplier=Element14; ComponentLink1Description: https://datasheet.ciiva.com/7983/1018594-7983558.pdf?src-supplier=Element14; ComponentLink2URL: https://datasheet.ciiva.com/2452/pyu-r-int-thick-7-2452756.pdf?src-supplier=Digikey; ComponentLink2Description: https://datasheet.ciiva.com/2452/pyu-r-int-thick-7-2452756.pdf?src-supplier=Digikey; Supplier 1: Digikey; Supplier Part Number 1: 311-1.0KJRCT-ND; ComponentLink3URL: https://datasheet.ciiva.com/2452/pyu-r-int-thick-7-2452757.pdf?src-supplier=Digikey; ComponentLink3Description: https://datasheet.ciiva.com/2452/pyu-r-int-thick-7-2452757.pdf?src-supplier=Digikey; ComponentLink4URL: https://datasheet.ciiva.com/2452/pyu-r-int-thick-7-2452755.pdf?src-supplier=Digikey; ComponentLink4Description: https://datasheet.ciiva.com/2452/pyu-r-int-thick-7-2452755.pdf?src-supplier=Digikey; ComponentLink5URL: https://datasheet.ciiva.com/7850/1018594-7850170.pdf?src-supplier=Element14; ComponentLink5Description: https://datasheet.ciiva.com/7850/1018594-7850170.pdf?src-supplier=Element14; ComponentLink6URL: https://datasheet.ciiva.com/7850/1018594-7850171.pdf?src-supplier=Element14; ComponentLink6Description: https://datasheet.ciiva.com/7850/1018594-7850171.pdf?src-supplier=Element14; ComponentLink7URL: https://datasheet.ciiva.com/17081/pyu-rc0402-51-rohs-l-6-r-17081438.pdf?src-supplier=Future+Electronics; ComponentLink7Description: https://datasheet.ciiva.com/17081/pyu-rc0402-51-rohs-l-6-r-17081438.pdf?src-supplier=Future+Electronics
R19 = RC0402FR-076K8L: 6.8 kΩ, 0402 Chip resistor; Manufacturer: Yageo; house_part_number: R-6.8k-0402-1%-001; Tolerance: 1%; Temperature Coefficient: 100ppm/°C; Power Rating: 63mW; Voltage Rating: 50V; Manufacturer Part Number: RC0402FR-076K8L; RoHS: Yes; Category: Chip SMD Resistors; Case Code (Metric): 1005; Case Code (Imperial): 0402; Min Operating Temperature: -55°C; Max Operating Temperature: 155°C; Resistor Type: Thick Film; Packaging: Tape and Reel; Termination: SMD/SMT; Series: RC; Resistance Tolerance: 1%; Construction: Rectangular; Voltage Rating (AC): 50V; Length: 0.039inch; Depth: 0.5mm; Reach SVHC Compliant: No; RoHS Compliant: Yes; Lead Free: 5697LeadFree; Military Standard: Not; ComponentLink1URL: https://datasheet.ciiva.com/11819/0900766b80c66297-11819535.pdf?src-supplier=Rs; ComponentLink1Description: https://datasheet.ciiva.com/11819/0900766b80c66297-11819535.pdf?src-supplier=Rs; Supplier 1: Digikey; Stock 1: 627630; Pricing 1: 10000=0.00261, 20000=0.00231, 30000=0.00216, 50000=0.00199, 100000=0.00179 (USD); Pins: 2; Voltage Rating (DC): 50V; Package Quantity: 1; Number of Terminations: 2; Max Power Dissipation: 63mW; Features: Moisture Resistant; Technology: THICK FILM; Width: 0.02inch; Height: 0.016inch; ComponentLink2URL: https://datasheet.ciiva.com/2453/pyu-r-int-thick-7-2453500.pdf?src-supplier=Digikey; ComponentLink2Description: https://datasheet.ciiva.com/2453/pyu-r-int-thick-7-2453500.pdf?src-supplier=Digikey; ComponentLink3URL: https://datasheet.ciiva.com/2453/pyu-r-int-thick-7-2453501.pdf?src-supplier=Digikey; ComponentLink3Description: https://datasheet.ciiva.com/2453/pyu-r-int-thick-7-2453501.pdf?src-supplier=Digikey; ComponentLink4URL: https://datasheet.ciiva.com/2453/pyu-r-int-thick-7-2453499.pdf?src-supplier=Digikey; ComponentLink4Description: https://datasheet.ciiva.com/2453/pyu-r-int-thick-7-2453499.pdf?src-supplier=Digikey; ComponentLink5URL: https://datasheet.ciiva.com/12668/pyu-rc0402-51-rohs-l-6-r-12668201.pdf?src-supplier=Mouser; ComponentLink5Description: https://datasheet.ciiva.com/12668/pyu-rc0402-51-rohs-l-6-r-12668201.pdf?src-supplier=Mouser; ComponentLink6URL: https://datasheet.ciiva.com/7850/1018594-7850078.pdf?src-supplier=Element14; ComponentLink6Description: https://datasheet.ciiva.com/7850/1018594-7850078.pdf?src-supplier=Element14; ComponentLink7URL: https://datasheet.ciiva.com/7850/1018594-7850079.pdf?src-supplier=Element14; ComponentLink7Description: https://datasheet.ciiva.com/7850/1018594-7850079.pdf?src-supplier=Element14; ComponentLink8URL: https://datasheet.ciiva.com/16741/pyu-rc0402-51-rohs-l-6-r-16741018.pdf?src-supplier=Future+Electronics; ComponentLink8Description: https://datasheet.ciiva.com/16741/pyu-rc0402-51-rohs-l-6-r-16741018.pdf?src-supplier=Future+Electronics; Supplier Part Number 1: 311-6.80KLRTR-ND
R20 = RC0402JR-071KL: 1 kΩ, 0402 Chip resistor; Manufacturer: Yageo; house_part_number: R-1k-0402-1%-001; Tolerance: 5%; Temperature Coefficient: 100ppm/°C; Power Rating: 62.5mW; Voltage Rating: 50V; Max Power Dissipation: 63mW; Manufacturer Part Number: RC0402JR-071KL; RoHS: Yes; Stock: 15490862; Pricing: 1=0.1, 10=0.018, 50=0.0102, 100=0.0083, 500=0.00528, 1000=0.00444, 5000=0.00307 (USD); Category: Chip SMD Resistors; Case Code (Metric): 1005; Case Code (Imperial): 0402; Min Operating Temperature: -55°C; Max Operating Temperature: 155°C; Resistor Type: Thick Film; Packaging: Cut Tape; Package Quantity: 1; Number of Terminations: 2; Termination: SMD/SMT; Features: Moisture Resistant; Series: RC; Resistance Tolerance: 5%; Voltage Rating (AC): 50V; Length: 0.039inch; Width: 0.02inch; Height: 0.016inch; Reach SVHC Compliant: No; RoHS Compliant: Yes; Lead Free: 5697LeadFree; ComponentLink1URL: https://datasheet.ciiva.com/7983/1018594-7983558.pdf?src-supplier=Element14; ComponentLink1Description: https://datasheet.ciiva.com/7983/1018594-7983558.pdf?src-supplier=Element14; ComponentLink2URL: https://datasheet.ciiva.com/2452/pyu-r-int-thick-7-2452756.pdf?src-supplier=Digikey; ComponentLink2Description: https://datasheet.ciiva.com/2452/pyu-r-int-thick-7-2452756.pdf?src-supplier=Digikey; ComponentLink3URL: https://datasheet.ciiva.com/2452/pyu-r-int-thick-7-2452757.pdf?src-supplier=Digikey; ComponentLink3Description: https://datasheet.ciiva.com/2452/pyu-r-int-thick-7-2452757.pdf?src-supplier=Digikey; ComponentLink4URL: https://datasheet.ciiva.com/2452/pyu-r-int-thick-7-2452755.pdf?src-supplier=Digikey; ComponentLink4Description: https://datasheet.ciiva.com/2452/pyu-r-int-thick-7-2452755.pdf?src-supplier=Digikey; ComponentLink5URL: https://datasheet.ciiva.com/7850/1018594-7850170.pdf?src-supplier=Element14; ComponentLink5Description: https://datasheet.ciiva.com/7850/1018594-7850170.pdf?src-supplier=Element14; ComponentLink6URL: https://datasheet.ciiva.com/7850/1018594-7850171.pdf?src-supplier=Element14; ComponentLink6Description: https://datasheet.ciiva.com/7850/1018594-7850171.pdf?src-supplier=Element14; ComponentLink7URL: https://datasheet.ciiva.com/17081/pyu-rc0402-51-rohs-l-6-r-17081438.pdf?src-supplier=Future+Electronics; ComponentLink7Description: https://datasheet.ciiva.com/17081/pyu-rc0402-51-rohs-l-6-r-17081438.pdf?src-supplier=Future+Electronics; Supplier 1: Digikey; Supplier Part Number 1: 311-1.0KJRCT-ND
R23-R25 R42 = RC0402FR-07100KL: 100 kΩ, 0402 Chip resistor; Manufacturer: Yageo; house_part_number: R-100k-0402-1%-001; Tolerance: 1%; Temperature Coefficient: 100ppm/°C; Power Rating: 63mW; Voltage Rating: 50V; Manufacturer Part Number: RC0402FR-07100KL; RoHS: Yes; Category: Chip SMD Resistors; Stock: 44340000; Pricing: 10000=0.0012, 50000=0.0011, 100000=0.0011, 250000=0.001, 300000=0.001, 500000=0.001, 750000=0.001, 1500000=0.0009, 2000000=0.0009 (USD); Case Code (Metric): 1005; Case Code (Imperial): 0402; Min Operating Temperature: -55°C; Max Operating Temperature: 155°C; Resistor Type: Thick Film; Packaging: Tape and Reel; Package Quantity: 1; Number of Terminations: 2; Termination: SMD/SMT; Max Power Dissipation: 63mW; Features: Moisture Resistant; Series: RC; Resistance Tolerance: 1%; Construction: Rectangular; Technology: THICK FILM; Voltage Rating (AC): 50V; Length: 0.039inch; Width: 0.02inch; Height: 0.016inch; Depth: 0.5mm; Reach SVHC Compliant: No; RoHS Compliant: Yes; Lead Free: 5697LeadFree; Military Standard: Not; ComponentLink1URL: https://datasheet.ciiva.com/11819/0900766b80c66297-11819452.pdf?src-supplier=Rs; ComponentLink1Description: https://datasheet.ciiva.com/11819/0900766b80c66297-11819452.pdf?src-supplier=Rs; ComponentLink2URL: https://datasheet.ciiva.com/22747/1018594-22747509.pdf?src-supplier=Element14; ComponentLink2Description: https://datasheet.ciiva.com/22747/1018594-22747509.pdf?src-supplier=Element14; ComponentLink3URL: https://datasheet.ciiva.com/2453/pyu-r-int-thick-7-2453362.pdf?src-supplier=Digikey; ComponentLink3Description: https://datasheet.ciiva.com/2453/pyu-r-int-thick-7-2453362.pdf?src-supplier=Digikey; ComponentLink4URL: https://datasheet.ciiva.com/12667/pyu-rc0402-51-rohs-l-6-r-12667930.pdf?src-supplier=Mouser; ComponentLink4Description: https://datasheet.ciiva.com/12667/pyu-rc0402-51-rohs-l-6-r-12667930.pdf?src-supplier=Mouser; ComponentLink5URL: https://datasheet.ciiva.com/15189/getdatasheetpartid-323696-15189334.pdf?src-supplier=Verical; ComponentLink5Description: https://datasheet.ciiva.com/15189/getdatasheetpartid-323696-15189334.pdf?src-supplier=Verical; ComponentLink6URL: https://datasheet.ciiva.com/2453/pyu-r-int-thick-7-2453363.pdf?src-supplier=Digikey; ComponentLink6Description: https://datasheet.ciiva.com/2453/pyu-r-int-thick-7-2453363.pdf?src-supplier=Digikey; ComponentLink7URL: https://datasheet.ciiva.com/2453/pyu-r-int-thick-7-2453361.pdf?src-supplier=Digikey; ComponentLink7Description: https://datasheet.ciiva.com/2453/pyu-r-int-thick-7-2453361.pdf?src-supplier=Digikey; Supplier 1: Future Electronics; Supplier Part Number 1: 6468466
R43 = RC0402FR-07442KL: 442 kΩ, 0402 Chip resistor; Manufacturer: Yageo; house_part_number: R-442k-0402-1%-001; Tolerance: 1%; Temperature Coefficient: 100ppm/°C; Power Rating: 62.5mW; Voltage Rating: 50V; Max Power Dissipation: 63mW; Manufacturer Part Number: RC0402FR-07442KL; RoHS: Yes; Category: Chip SMD Resistors; Stock: 40000; Pricing: 10000=0.0012, 50000=0.0011, 250000=0.001, 500000=0.001, 1500000=0.0009 (USD); Contact Plating: Tin,Lead; Case Code (Metric): 1005; Case Code (Imperial): 0402; Min Operating Temperature: -55°C; Max Operating Temperature: 155°C; Packaging: Tape and Reel; Package Quantity: 1; Number of Terminations: 2; Termination: SMD/SMT; Features: Moisture Resistant; Series: RC; Construction: Rectangular; Voltage Rating (DC): 50V; Length: 1mm; Width: 0.02inch; Height: 0.016inch; Depth: 0.5mm; Military Standard: Not; RoHS Compliant: Yes; ComponentLink1URL: https://datasheet.ciiva.com/2453/pyu-r-int-thick-7-2453668.pdf?src-supplier=Digikey; ComponentLink1Description: https://datasheet.ciiva.com/2453/pyu-r-int-thick-7-2453668.pdf?src-supplier=Digikey; ComponentLink2URL: https://datasheet.ciiva.com/2453/pyu-r-int-thick-7-2453667.pdf?src-supplier=Digikey; ComponentLink2Description: https://datasheet.ciiva.com/2453/pyu-r-int-thick-7-2453667.pdf?src-supplier=Digikey; ComponentLink3URL: https://datasheet.ciiva.com/2453/pyu-r-int-thick-7-2453669.pdf?src-supplier=Digikey; ComponentLink3Description: https://datasheet.ciiva.com/2453/pyu-r-int-thick-7-2453669.pdf?src-supplier=Digikey; ComponentLink4URL: https://datasheet.ciiva.com/8885/pyu-rc0402-51-rohs-l-6-8885693.pdf?src-supplier=Avnet; ComponentLink4Description: https://datasheet.ciiva.com/8885/pyu-rc0402-51-rohs-l-6-8885693.pdf?src-supplier=Avnet; Supplier 1: Future Electronics; Supplier Part Number 1: 1075035
TP2 TP4-TP11 TP47 TP63-TP65 = test_point-1: Test point; pickable: no
U2 = SRV05-4A: TVS DIODE ARRAY SOT23-6; Manufacturer: SMC Diodes; Direction: Unidirectional,Bidirectional; Capacitance: 3.5pF; Operating Supply Voltage: 1.1V; Number of Channels: 2; Breakdown Voltage: 6V; Clamping Voltage: 17V; Reverse Standoff Voltage: 5.25V; Power Line Protection: Yes; Test Current: 1mA; Max Reverse Leakage Current: 150nA; Peak Pulse Current: 5A; Element Configuration: Dual; Data Rate: 480Mbps; Number of Elements: 1; Working Voltage: 5V; RoHS: Yes; Category: TVS Diodes; Stock: 12000; Pricing: 3000=0,05640 (USD); Mount: Surface Mount; Number of Pins: 6; Contact Plating: Tin,Matte; Min Operating Temperature: -40°C; Max Operating Temperature: 125°C; Packaging: Tape and Reel; Package Quantity: 3000; Termination: SMD/SMT; Number of Bidirectional Channels: 2; Min Breakdown Voltage: 6V; ESD Protection: Yes; Leakage Current: 150nA; Series: USB; Reverse Breakdown Voltage: 6V; Polarity: Unidirectional,Bidirectional; Max Breakdown Voltage: 6V; Clamping Voltage-Max: 17V; Length: 3.05mm; Width: 1.75mm; Height: 1.3mm; Depth: 1.75mm; Radiation Hardening: No; REACH SVHC: No SVHC; Lead Free: Lead Free; RoHS Compliant: Yes; ComponentLink1URL: https://datasheet.ciiva.com/1268/1690354-1268384.pdf?src-supplier=Element14; ComponentLink1Description: https://datasheet.ciiva.com/1268/1690354-1268384.pdf?src-supplier=Element14; ComponentLink2URL: https://datasheet.ciiva.com/4508/cd00050750-113117-4508433.pdf?src-supplier=Mouser; ComponentLink2Description: https://datasheet.ciiva.com/4508/cd00050750-113117-4508433.pdf?src-supplier=Mouser; ComponentLink3URL: https://datasheet.ciiva.com/15143/getdatasheetpartid-148465-15143789.pdf?src-supplier=Verical; ComponentLink3Description: https://datasheet.ciiva.com/15143/getdatasheetpartid-148465-15143789.pdf?src-supplier=Verical; ComponentLink4URL: https://datasheet.ciiva.com/16200/cd00050750-16200026.pdf?src-supplier=Future+Electronics; ComponentLink4Description: https://datasheet.ciiva.com/16200/cd00050750-16200026.pdf?src-supplier=Future+Electronics; ComponentLink5URL: https://datasheet.ciiva.com/41444/001184109-da-01-en-ic-esd-protecti-usblc6-2sc6-sot-23-6-stm-41444156.pdf?src-supplier=Conrad; ComponentLink5Description: https://datasheet.ciiva.com/41444/001184109-da-01-en-ic-esd-protecti-usblc6-2sc6-sot-23-6-stm-41444156.pdf?src-supplier=Conrad; Supplier 1: LCSC; Supplier Part Number 1: C260410; Manufacturer Part Number: SRV05-4A; house_part_number: SRV05-4A
U3 = LGS4056H: Battery Charger, DFN-8(2x2); Case/Package: DFN-8(2x2); Supplier 1: LCSC; house_part_number: LGS4056HDA; Supplier Part Number 1: C5124109
U4 = MIC2876-5.0YMT-TR: 5V Synchronous Boost, UDFN-8; Manufacturer: Microchip; Number of Outputs: 1; Min Input Voltage: 2.5V; Max Supply Voltage: 5.5V; Output Current: 3.8A; Switching Frequency: 2MHz; Synchronous Rectifier: No; Output Type: Fixed; Output Configuration: Positive; Supplier: Digikey; Supplier Part Number: 150-MIC2876-5.0YMT-TRCT-ND; RoHS: Yes; Category: Voltage Regulators - Switching; Stock: 6514; Pricing: 1=0.97, 25=0.8, 100=0.73, 5000=0.73 (USD); Mounting Technology: Surface Mount; Min Operating Temperature: -40°C; Max Operating Temperature: 125°C; Packaging: Tape and Reel; Min Output Voltage: 5V; Topology: Boost; Series: -; RoHS Compliant: Yes; ComponentLink1URL: http://www.microchip.com/mymicrochip/filehandler.aspx?ddocname=en580787&src-supplier=Digikey; ComponentLink1Description: http://www.microchip.com/mymicrochip/filehandler.aspx?ddocname=en580787&src-supplier=Digikey; ComponentLink2URL: https://datasheet.octopart.com/MIC2876-5.0YMT-TR-Microchip-datasheet-175858781.pdf?src-supplier=Electro+Sonic; ComponentLink2Description: https://datasheet.octopart.com/MIC2876-5.0YMT-TR-Microchip-datasheet-175858781.pdf?src-supplier=Electro+Sonic; ComponentLink3URL: https://datasheet.octopart.com/MIC2876-5.0YMT-TR-Microchip-datasheet-175858781.pdf?src-supplier=microchipDIRECT; ComponentLink3Description: https://datasheet.octopart.com/MIC2876-5.0YMT-TR-Microchip-datasheet-175858781.pdf?src-supplier=microchipDIRECT; ComponentLink4URL: https://datasheet.octopart.com/MIC2876-5.0YMT-TR-Microchip-datasheet-175858781.pdf?src-supplier=Master+Electronics; ComponentLink4Description: https://datasheet.octopart.com/MIC2876-5.0YMT-TR-Microchip-datasheet-175858781.pdf?src-supplier=Master+Electronics; ComponentLink5URL: https://datasheet.octopart.com/MIC2876-5.0YMT-TR-Microchip-datasheet-86810323.pdf?src-supplier=SHENGYU+ELECTRONICS; ComponentLink5Description: https://datasheet.octopart.com/MIC2876-5.0YMT-TR-Microchip-datasheet-86810323.pdf?src-supplier=SHENGYU+ELECTRONICS; ComponentLink6URL: https://datasheet.octopart.com/MIC2876-5.0YMT-TR-Microchip-datasheet-142675560.pdf?src-supplier=TME; ComponentLink6Description: https://datasheet.octopart.com/MIC2876-5.0YMT-TR-Microchip-datasheet-142675560.pdf?src-supplier=TME; Manufacturer Part Number: MIC2876-5.0YMT-TR
U9 = TLV62569DBVR: Buck converter, 2.5-5.5 Vin, 0.6 - 5.5 Vout, 2A, SOT-23-5; Manufacturer: Texas Instruments; Output Type: Adjustable; Output Configuration: Positive; Min Input Voltage: 2.5V; Max Supply Voltage: 5.5V; Min Output Voltage: 600mV; Switching Frequency: 1.5MHz; Synchronous Rectifier: Yes; Supplier: Mouser; Supplier Part Number: 595-TLV62569DBVR; RoHS: Yes; Category: Voltage Regulators - Switching; Stock: 12579; Pricing: 1=0.45, 10=0.344, 50=0.344, 100=0.214, 1000=0.113, 10000=0.087 (USD); Mounting Technology: Surface Mount; Min Operating Temperature: -40°C; Max Operating Temperature: 125°C; Packaging: Cut Tape; Max Output Voltage: 5.5V; Output Current: 2A; Series: -; RoHS Compliant: Yes; ComponentLink1URL: http://www.ti.com/lit/ds/symlink/tlv62569.pdf?src-supplier=Digikey; ComponentLink1Description: http://www.ti.com/lit/ds/symlink/tlv62569.pdf?src-supplier=Digikey; ComponentLink2URL: http://www.ti.com/lit/ds/symlink/tlv62569.pdf?src-supplier=Farnell; ComponentLink2Description: http://www.ti.com/lit/ds/symlink/tlv62569.pdf?src-supplier=Farnell; Supplier 1: LCSC; Supplier Part Number 1: C141836; Manufacturer Part Number: TLV62569DBVR; house_part_number: TLV62569DBVR